# Altium schematic sheet PT100.SchDoc
size A3
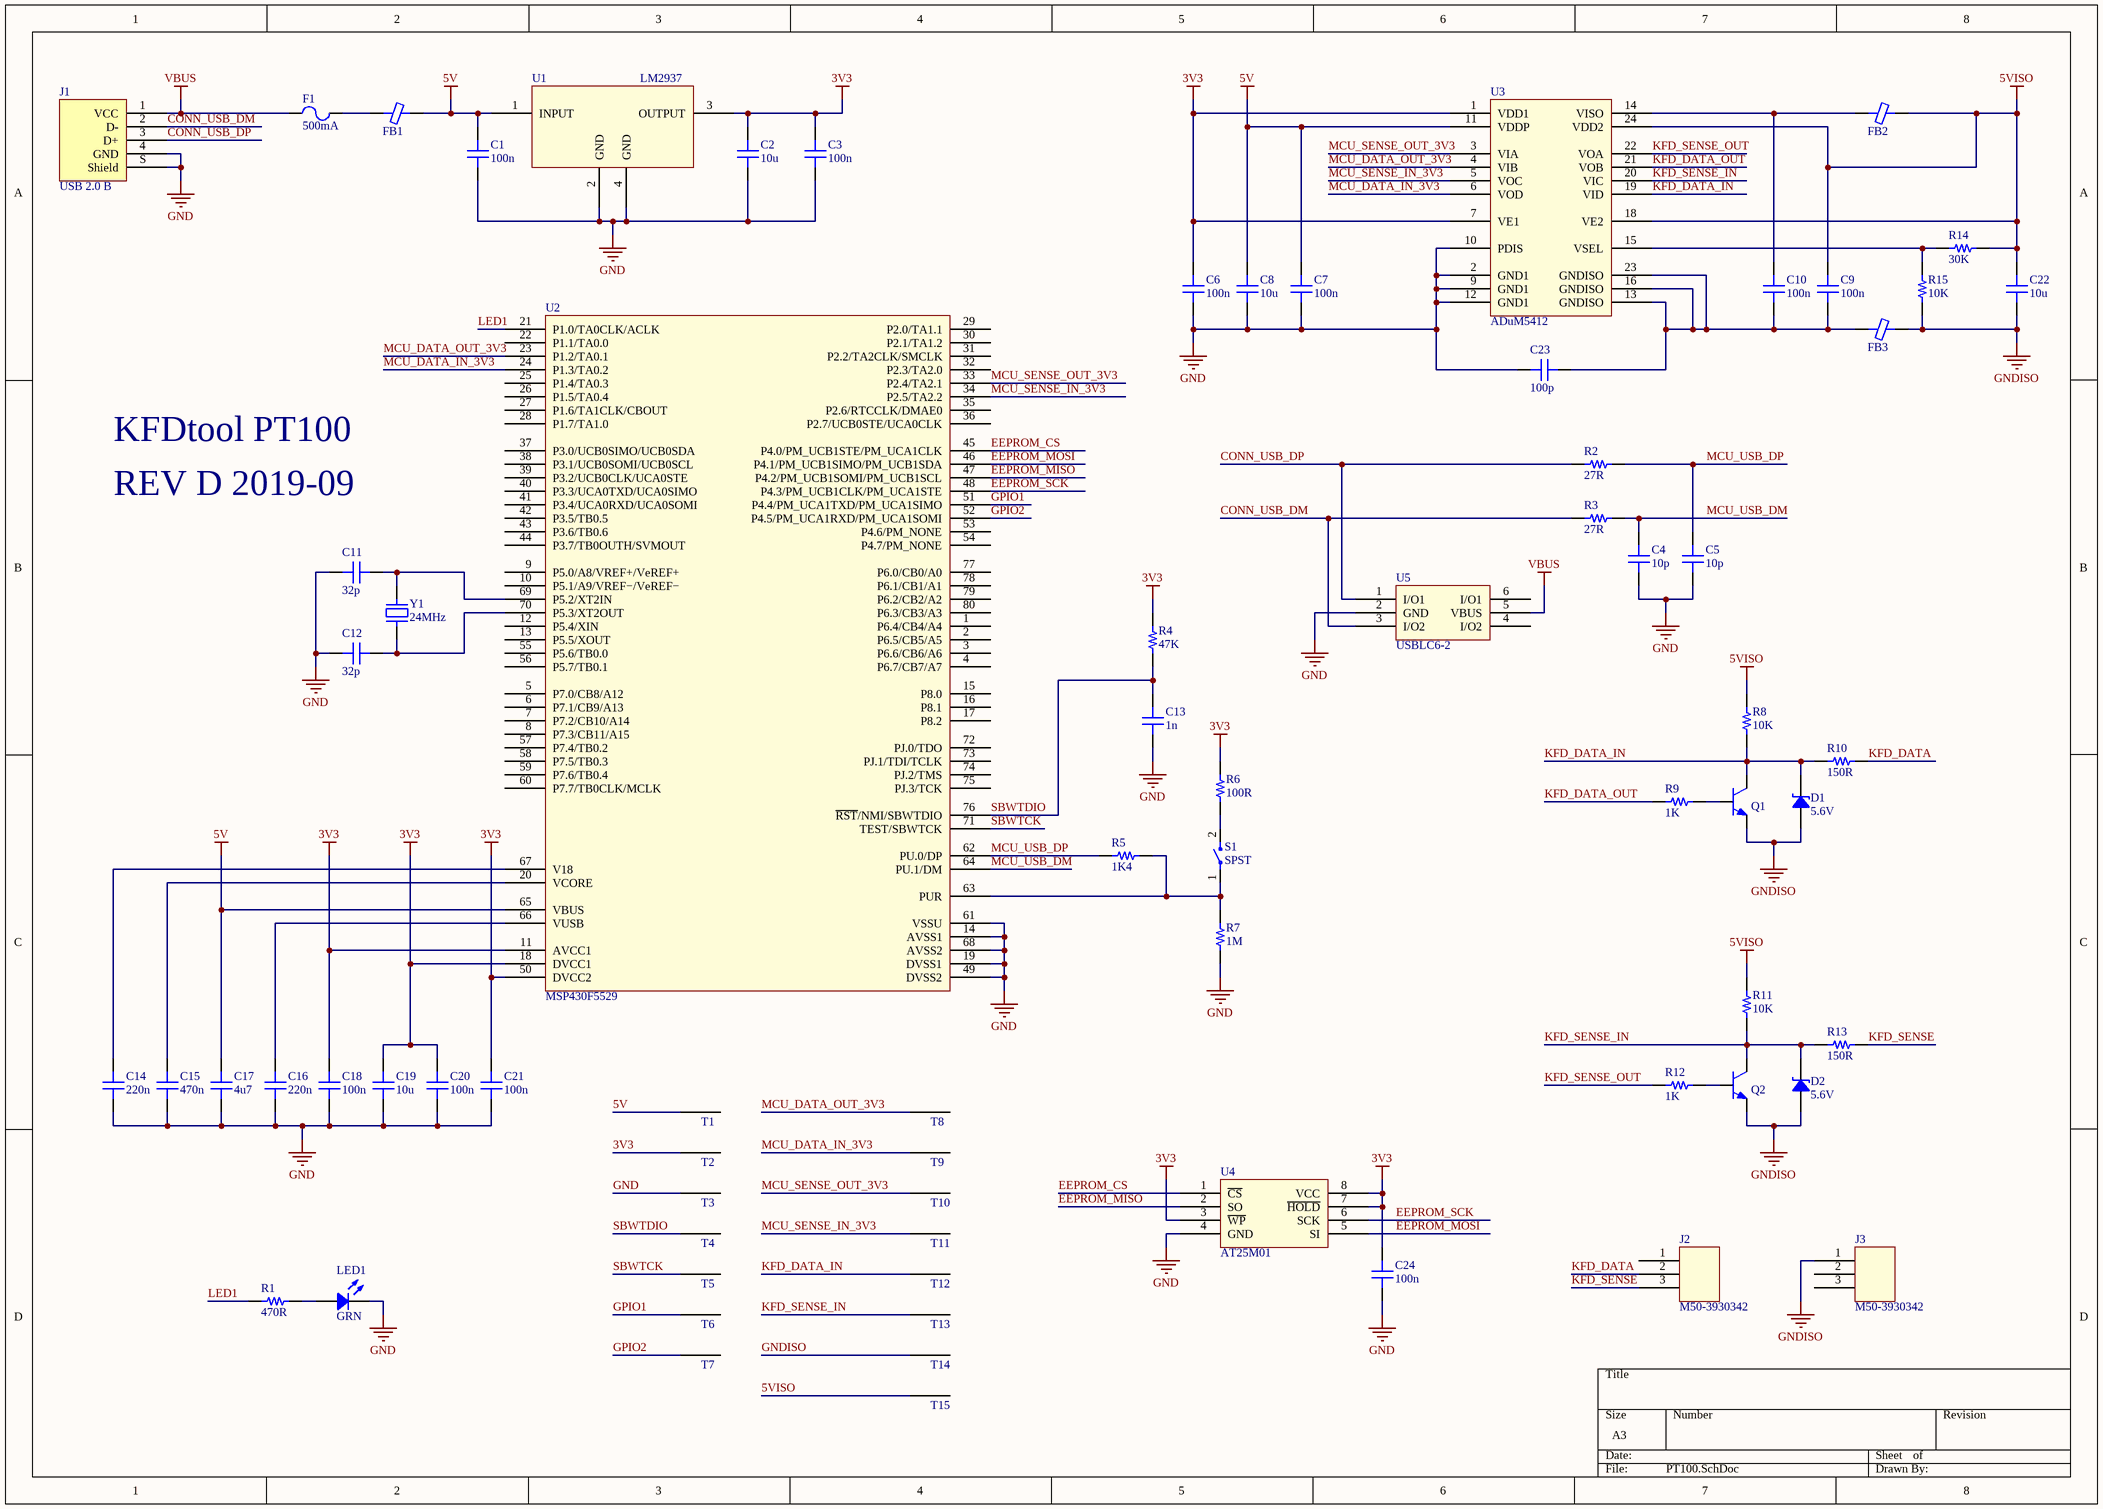
[diagram p0: PT100.SchDoc]

## Parts
C1  100n  [CAP 0603]
C2  10u  [CAP 0603]
C3  100n  [CAP 0603]
C4  10p  [CAP 0603]
C5  10p  [CAP 0603]
C6  100n  [CAP 0603]
C7  100n  [CAP 0603]
C8  10u  [CAP 0603]
C9  100n  [CAP 0603]
C10  100n  [CAP 0603]
C11  32p  [CAP 0603]
C12  32p  [CAP 0603]
C13  1n  [CAP 0603]
C14  220n  [CAP 0603]
C15  470n  [CAP 0603]
C16  220n  [CAP 0603]
C17  4u7  [CAP 0603]
C18  100n  [CAP 0603]
C19  10u  [CAP 0603]
C20  100n  [CAP 0603]
C21  100n  [CAP 0603]
C22  10u  [CAP 0603]
C23  100p  [CAP 1812]
C24  100n  [CAP 0603]
D1  5.6V  [ON SEMI SOT-23-3]
D2  5.6V  [ON SEMI SOT-23-3]
F1  500mA  [PTC 2920]
FB1  Ferrite Chip  [CAP 0603]  (value not drawn)
FB2  Ferrite Chip  [CAP 0603]  (value not drawn)
FB3  Ferrite Chip  [CAP 0603]  (value not drawn)
J1  USB 2.0 B  [FCI 61729-1011BLF]
J2  M50-3930342  [HWN M50-3930342]
J3  M50-3930342  [HWN M50-3930342]
LED1  GRN  [KBRT WP934CB/GD]
Q1  NPN Transistor  [ON SEMI SOT-23-3]  (value not drawn)
Q2  NPN Transistor  [ON SEMI SOT-23-3]  (value not drawn)
R1  470R  [RES 0603]
R2  27R  [RES 0603]
R3  27R  [RES 0603]
R4  47K  [RES 0603]
R5  1K4  [RES 0603]
R6  100R  [RES 0603]
R7  1M  [RES 0603]
R8  10K  [RES 0603]
R9  1K  [RES 0603]
R10  150R  [RES 0603]
R11  10K  [RES 0603]
R12  1K  [RES 0603]
R13  150R  [RES 0603]
R14  30K  [RES 0603]
R15  10K  [RES 0603]
S1  SPST  [ESWI TL3340AF160QG]
T1  Test Point  [TEST POINT]  (value not drawn)
T2  Test Point  [TEST POINT]  (value not drawn)
T3  Test Point  [TEST POINT]  (value not drawn)
T4  Test Point  [TEST POINT]  (value not drawn)
T5  Test Point  [TEST POINT]  (value not drawn)
T6  Test Point  [TEST POINT]  (value not drawn)
T7  Test Point  [TEST POINT]  (value not drawn)
T8  Test Point  [TEST POINT]  (value not drawn)
T9  Test Point  [TEST POINT]  (value not drawn)
T10  Test Point  [TEST POINT]  (value not drawn)
T11  Test Point  [TEST POINT]  (value not drawn)
T12  Test Point  [TEST POINT]  (value not drawn)
T13  Test Point  [TEST POINT]  (value not drawn)
T14  Test Point  [TEST POINT]  (value not drawn)
T15  Test Point  [TEST POINT]  (value not drawn)
U1  LM2937  [TI LM2937IMP-3.3/NOPB]
U2  MSP430F5529  [TI MSP430F5529IPNR]
U3  ADuM5412  [AD RS-24]
U4  AT25M01  [ATML 8S1]
U5  USBLC6-2  [ST SOT23-6L]
Y1  24MHz  [ABRA ABLS2]

## Nets
3V3: C2.2 C3.2 C6.2 C18.2 C19.2 C20.2 C21.2 C24.2 R4.2 R6.2 T2.1 U1.3(OUTPUT) U2.11(AVCC1) U2.18(DVCC1) U2.50(DVCC2) U3.1(VDD1) U3.7(VE1) U4.3(~{WP}) U4.7(~{HOLD}) U4.8(VCC)
5V: C1.2 C7.2 C8.2 C17.2 FB1.2 T1.1 U1.1(INPUT) U2.65(VBUS) U3.11(VDDP)
5VISO: C9.2 C22.2 FB2.2 R8.2 R11.2 R14.1 T15.1 U3.18(VE2) U3.24(VDD2)
GND: C1.1 C2.1 C3.1 C4.1 C5.1 C6.1 C7.1 C8.1 C11.1 C12.1 C13.1 C14.1 C15.1 C16.1 C17.1 C18.1 C19.1 C20.1 C21.1 C23.1 C24.1 J1.4(GND) J1.S(Shield) LED1.2 R7.1 T3.1 U1.2(GND) U1.4(GND) U2.14(AVSS1) U2.19(DVSS1) U2.49(DVSS2) U2.61(VSSU) U2.68(AVSS2) U3.2(GND1) U3.9(GND1) U3.10(PDIS) U3.12(GND1) U4.4(GND) U5.2(GND)
GNDISO: C22.1 D1.A D2.A FB3.2 J3.1 Q1.E Q2.E R15.1 T14.1
VBUS: F1.1 J1.1(VCC) U5.5(VBUS)
CONN_USB_DM: J1.2(D-) R3.1 U5.3(I/O2)
CONN_USB_DP: J1.3(D+) R2.1 U5.1(I/O1)
EEPROM_CS: U2.45(P4.0/PM_UCB1STE/PM_UCA1CLK) U4.1(~{CS})
EEPROM_MISO: U2.47(P4.2/PM_UCB1SOMI/PM_UCB1SCL) U4.2(SO)
EEPROM_MOSI: U2.46(P4.1/PM_UCB1SIMO/PM_UCB1SDA) U4.5(SI)
EEPROM_SCK: U2.48(P4.3/PM_UCB1CLK/PM_UCA1STE) U4.6(SCK)
GPIO1: T6.1 U2.51(P4.4/PM_UCA1TXD/PM_UCA1SIMO)
GPIO2: T7.1 U2.52(P4.5/PM_UCA1RXD/PM_UCA1SOMI)
KFD_DATA: J2.2 R10.2
KFD_DATA_IN: D1.C Q1.C R8.1 R10.1 T12.1 U3.19(VID)
KFD_DATA_OUT: R9.1 U3.21(VOB)
KFD_SENSE: J2.3 R13.2
KFD_SENSE_IN: D2.C Q2.C R11.1 R13.1 T13.1 U3.20(VIC)
KFD_SENSE_OUT: R12.1 U3.22(VOA)
LED1: R1.1 U2.21(P1.0/TA0CLK/ACLK)
MCU_DATA_IN_3V3: T9.1 U2.24(P1.3/TA0.2) U3.6(VOD)
MCU_DATA_OUT_3V3: T8.1 U2.23(P1.2/TA0.1) U3.4(VIB)
MCU_SENSE_IN_3V3: T11.1 U2.34(P2.5/TA2.2) U3.5(VOC)
MCU_SENSE_OUT_3V3: T10.1 U2.33(P2.4/TA2.1) U3.3(VIA)
MCU_USB_DM: C4.2 R3.2 U2.64(PU.1/DM)
MCU_USB_DP: C5.2 R2.2 R5.1 U2.62(PU.0/DP)
SBWTCK: T5.1 U2.71(TEST/SBWTCK)
SBWTDIO: C13.2 R4.1 T4.1 U2.76(~{RST}/NMI/SBWTDIO)
NetC9_1: C9.1 C10.1 C23.2 FB3.1 U3.13(GNDISO) U3.16(GNDISO) U3.23(GNDISO)
NetC10_2: C10.2 FB2.1 U3.14(VISO)
NetC11_2: C11.2 U2.69(P5.2/XT2IN) Y1.2
NetC12_2: C12.2 U2.70(P5.3/XT2OUT) Y1.1
NetC14_2: C14.2 U2.67(V18)
NetC15_2: C15.2 U2.20(VCORE)
NetC16_2: C16.2 U2.66(VUSB)
NetF1_2: F1.2 FB1.1
NetLED1_1: LED1.1 R1.2
NetQ1_B: Q1.B R9.2
NetQ2_B: Q2.B R12.2
NetR5_2: R5.2 R7.2 S1.1 U2.63(PUR)
NetR6_1: R6.1 S1.2
NetR14_2: R14.2 R15.2 U3.15(VSEL)

Not connected (* = marked no-connect by the designer): J2 1; J3 2 3; U2 1(P6.4/CB4/A4) 2(P6.5/CB5/A5) 3(P6.6/CB6/A6) 4(P6.7/CB7/A7) 5(P7.0/CB8/A12) 6(P7.1/CB9/A13) 7(P7.2/CB10/A14) 8(P7.3/CB11/A15) 9(P5.0/A8/VREF+/VeREF+) 10(P5.1/A9/VREF−/VeREF−) 12(P5.4/XIN) 13(P5.5/XOUT) 15(P8.0) 16(P8.1) 17(P8.2) 22(P1.1/TA0.0) 25(P1.4/TA0.3) 26(P1.5/TA0.4) 27(P1.6/TA1CLK/CBOUT) 28(P1.7/TA1.0) 29(P2.0/TA1.1) 30(P2.1/TA1.2) 31(P2.2/TA2CLK/SMCLK) 32(P2.3/TA2.0) 35(P2.6/RTCCLK/DMAE0) 36(P2.7/UCB0STE/UCA0CLK) 37(P3.0/UCB0SIMO/UCB0SDA) 38(P3.1/UCB0SOMI/UCB0SCL) 39(P3.2/UCB0CLK/UCA0STE) 40(P3.3/UCA0TXD/UCA0SIMO) 41(P3.4/UCA0RXD/UCA0SOMI) 42(P3.5/TB0.5) 43(P3.6/TB0.6) 44(P3.7/TB0OUTH/SVMOUT) 53(P4.6/PM_NONE) 54(P4.7/PM_NONE) 55(P5.6/TB0.0) 56(P5.7/TB0.1) 57(P7.4/TB0.2) 58(P7.5/TB0.3) 59(P7.6/TB0.4) 60(P7.7/TB0CLK/MCLK) 72(PJ.0/TDO) 73(PJ.1/TDI/TCLK) 74(PJ.2/TMS) 75(PJ.3/TCK) 77(P6.0/CB0/A0) 78(P6.1/CB1/A1) 79(P6.2/CB2/A2) 80(P6.3/CB3/A3); U5 4(I/O2) 6(I/O1)

## Notes on the sheet
- KFDtool PT100
- REV D 2019-09

## Library data of the parts
C1-C10 C13-C24 = Capacitor
  C1 C3 C6 C7 C9 C10 C18 C20 C21 C24: Value: 100n
  C2 C8 C19 C22: Value: 10u
  C4 C5: Value: 10p
  C13: Value: 1n
  C14 C16: Value: 220n
  C15: Value: 470n
  C17: Value: 4u7
  C23: Value: 100p
C11 C12 = Capacitor: Value: 0.1uF
D1 D2 = Zener Diode: pin to pad: A>1 C>3; Value: 5.6V
F1 = PTC: Value: 500mA
J1 = FCI 61729-1011BLF
J2 J3 = HWN M50-3930342
LED1 = LED
Q1 Q2 = NPN Transistor: pin to pad: B>1 C>3 E>2
R1-R15 = Resistor
  R1: Value: 470R
  R2 R3: Value: 27R
  R4: Value: 47K
  R5: Value: 1K4
  R6: Value: 100R
  R7: Value: 1M
  R8 R11 R15: Value: 10K
  R9 R12: Value: 1K
  R10 R13: Value: 150R
  R14: Value: 30K
S1 = SPST Switch
U1 = TI LM2937
U2 = TI MSP430F5529
U3 = AD ADuM5412
U4 = ATML AT25M01
U5 = ST USBLC6-2
Y1 = Crystal: Value: 24MHz